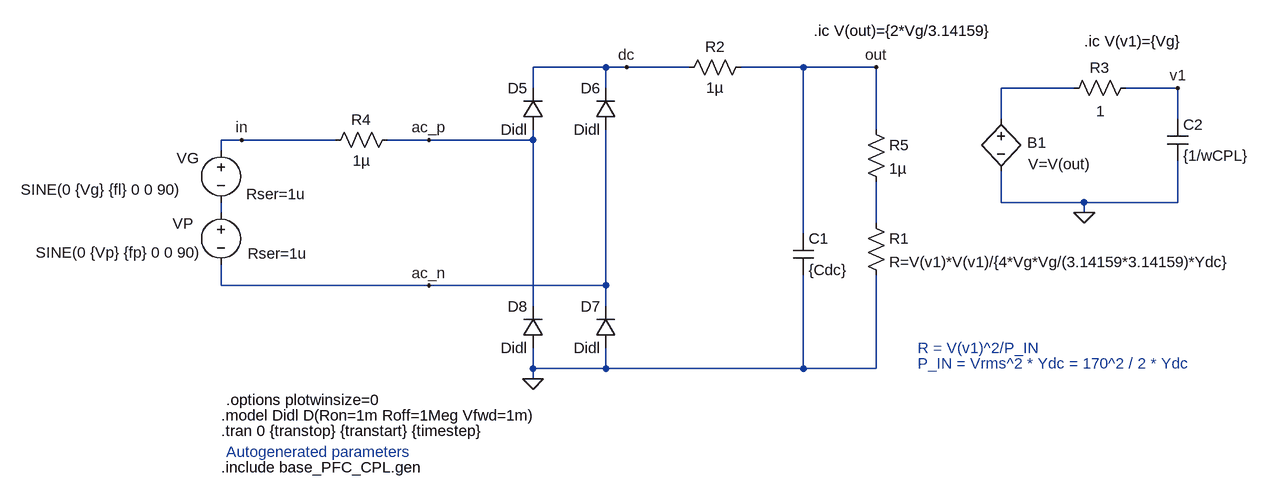
[diagram p0: schematic base_PFC_CPL.asc]
base_PFC_CPL.asc, the LTspice schematic file:
Version 4
SHEET 1 2640 776
WIRE 512 -480 400 -480
WIRE 544 -480 512 -480
WIRE 640 -480 544 -480
WIRE 816 -480 720 -480
WIRE 928 -480 816 -480
WIRE 400 -448 400 -480
WIRE 512 -448 512 -480
WIRE 1232 -448 1120 -448
WIRE 1392 -448 1312 -448
WIRE 1120 -400 1120 -448
WIRE 1392 -400 1392 -448
WIRE 928 -384 928 -480
WIRE -48 -368 -80 -368
WIRE 96 -368 -48 -368
WIRE 240 -368 176 -368
WIRE 400 -368 400 -384
WIRE 400 -368 240 -368
WIRE -80 -352 -80 -368
WIRE 1120 -272 1120 -320
WIRE 1248 -272 1120 -272
WIRE 1392 -272 1392 -336
WIRE 1392 -272 1248 -272
WIRE -80 -256 -80 -272
WIRE 1248 -256 1248 -272
WIRE 928 -240 928 -304
WIRE 816 -224 816 -480
WIRE -80 -144 -80 -176
WIRE 240 -144 -80 -144
WIRE 512 -144 512 -384
WIRE 512 -144 240 -144
WIRE 400 -112 400 -368
WIRE 512 -112 512 -144
WIRE 400 -16 400 -48
WIRE 512 -16 512 -48
WIRE 512 -16 400 -16
WIRE 816 -16 816 -160
WIRE 816 -16 512 -16
WIRE 928 -16 928 -160
WIRE 928 -16 816 -16
WIRE 400 0 400 -16
FLAG 400 0 0
FLAG 544 -480 dc
FLAG 240 -368 ac_p
FLAG 240 -144 ac_n
FLAG 928 -480 out
FLAG -48 -368 in
FLAG 1248 -256 0
FLAG 1392 -448 v1
SYMBOL res 80 -352 R270
WINDOW 0 32 56 VTop 2
WINDOW 3 0 56 VBottom 2
SYMATTR InstName R4
SYMATTR Value 1µ
SYMBOL diode 416 -384 R180
WINDOW 0 24 64 Left 2
WINDOW 3 24 0 Left 2
SYMATTR InstName D5
SYMATTR Value Didl
SYMBOL diode 528 -384 R180
WINDOW 0 24 64 Left 2
WINDOW 3 24 0 Left 2
SYMATTR InstName D6
SYMATTR Value Didl
SYMBOL diode 528 -48 R180
WINDOW 0 24 64 Left 2
WINDOW 3 24 0 Left 2
SYMATTR InstName D7
SYMATTR Value Didl
SYMBOL diode 416 -48 R180
WINDOW 0 24 64 Left 2
WINDOW 3 24 0 Left 2
SYMATTR InstName D8
SYMATTR Value Didl
SYMBOL voltage -80 -368 R0
WINDOW 123 0 0 Left 2
WINDOW 39 39 83 Left 2
WINDOW 3 -308 76 Left 2
WINDOW 0 -68 28 Left 2
SYMATTR SpiceLine Rser=1u
SYMATTR Value SINE(0 {Vg} {fl} 0 0 90)
SYMATTR InstName VG
SYMBOL voltage -80 -272 R0
WINDOW 0 -74 33 Left 2
WINDOW 39 41 79 Left 2
WINDOW 3 -285 77 Left 2
WINDOW 123 0 0 Left 0
SYMATTR InstName VP
SYMATTR SpiceLine Rser=1u
SYMATTR Value SINE(0 {Vp} {fp} 0 0 90)
SYMBOL cap 800 -224 R0
SYMATTR InstName C1
SYMATTR Value {Cdc}
SYMATTR SpiceLine Rser=1u
SYMBOL res 912 -256 R0
SYMATTR InstName R1
SYMATTR Value R=V(v1)*V(v1)/{4*Vg*Vg/(3.14159*3.14159)*Ydc}
SYMBOL res 624 -464 R270
WINDOW 0 32 56 VTop 2
WINDOW 3 0 56 VBottom 2
SYMATTR InstName R2
SYMATTR Value 1µ
SYMBOL bv 1120 -416 R0
WINDOW 0 40 52 Left 2
WINDOW 3 42 85 Left 2
SYMATTR InstName B1
SYMATTR Value V=V(out)
SYMBOL cap 1376 -400 R0
SYMATTR InstName C2
SYMATTR Value {1/wCPL}
SYMATTR SpiceLine Rser=1u
SYMBOL res 1328 -464 R90
WINDOW 0 0 56 VBottom 2
WINDOW 3 36 55 VTop 2
SYMATTR InstName R3
SYMATTR Value 1
SYMBOL res 912 -400 R0
SYMATTR InstName R5
SYMATTR Value 1µ
TEXT -80 56 Left 2 !.model Didl D(Ron=1m Roff=1Meg Vfwd=1m)
TEXT -80 136 Left 2 !.include base_PFC_CPL.gen
TEXT -72 112 Left 2 ;Autogenerated parameters
TEXT -80 80 Left 2 !.tran 0 {transtop} {transtart} {timestep}
TEXT 1248 -520 Left 2 !.ic V(v1)={Vg}
TEXT 992 -24 Left 2 ;P_IN = Vrms^2 * Ydc = 170^2 / 2 * Ydc
TEXT 992 -48 Left 2 ;R = V(v1)^2/P_IN
TEXT 832 -536 Left 2 !.ic V(out)={2*Vg/3.14159}
TEXT -72 32 Left 2 !.options plotwinsize=0

The netlist it stands for:
* base_PFC_CPL.asc
R4 in ac_p 1µ
D5 ac_p dc Didl
D6 ac_n dc Didl
D7 0 ac_n Didl
D8 0 ac_p Didl
VG in N002 SINE(0 {Vg} {fl} 0 0 90) Rser=1u
VP N002 ac_n SINE(0 {Vp} {fp} 0 0 90) Rser=1u
C1 out 0 {Cdc} Rser=1u
R1 N003 0 R=V(v1)*V(v1)/{4*Vg*Vg/(3.14159*3.14159)*Ydc}
R2 dc out 1µ
B1 N001 0 V=V(out)
C2 v1 0 {1/wCPL} Rser=1u
R3 v1 N001 1
R5 out N003 1µ
.model D D
.lib standard.dio
.model Didl D(Ron=1m Roff=1Meg Vfwd=1m)
.include base_PFC_CPL.gen
* Autogenerated parameters
.tran 0 {transtop} {transtart} {timestep}
.ic V(v1)={Vg}
* P_IN = Vrms^2 * Ydc = 170^2 / 2 * Ydc
* R = V(v1)^2/P_IN
.ic V(out)={2*Vg/3.14159}
.options plotwinsize=0
.backanno
.end